# EAGLE design stmwerk (EAGLE 5.11)
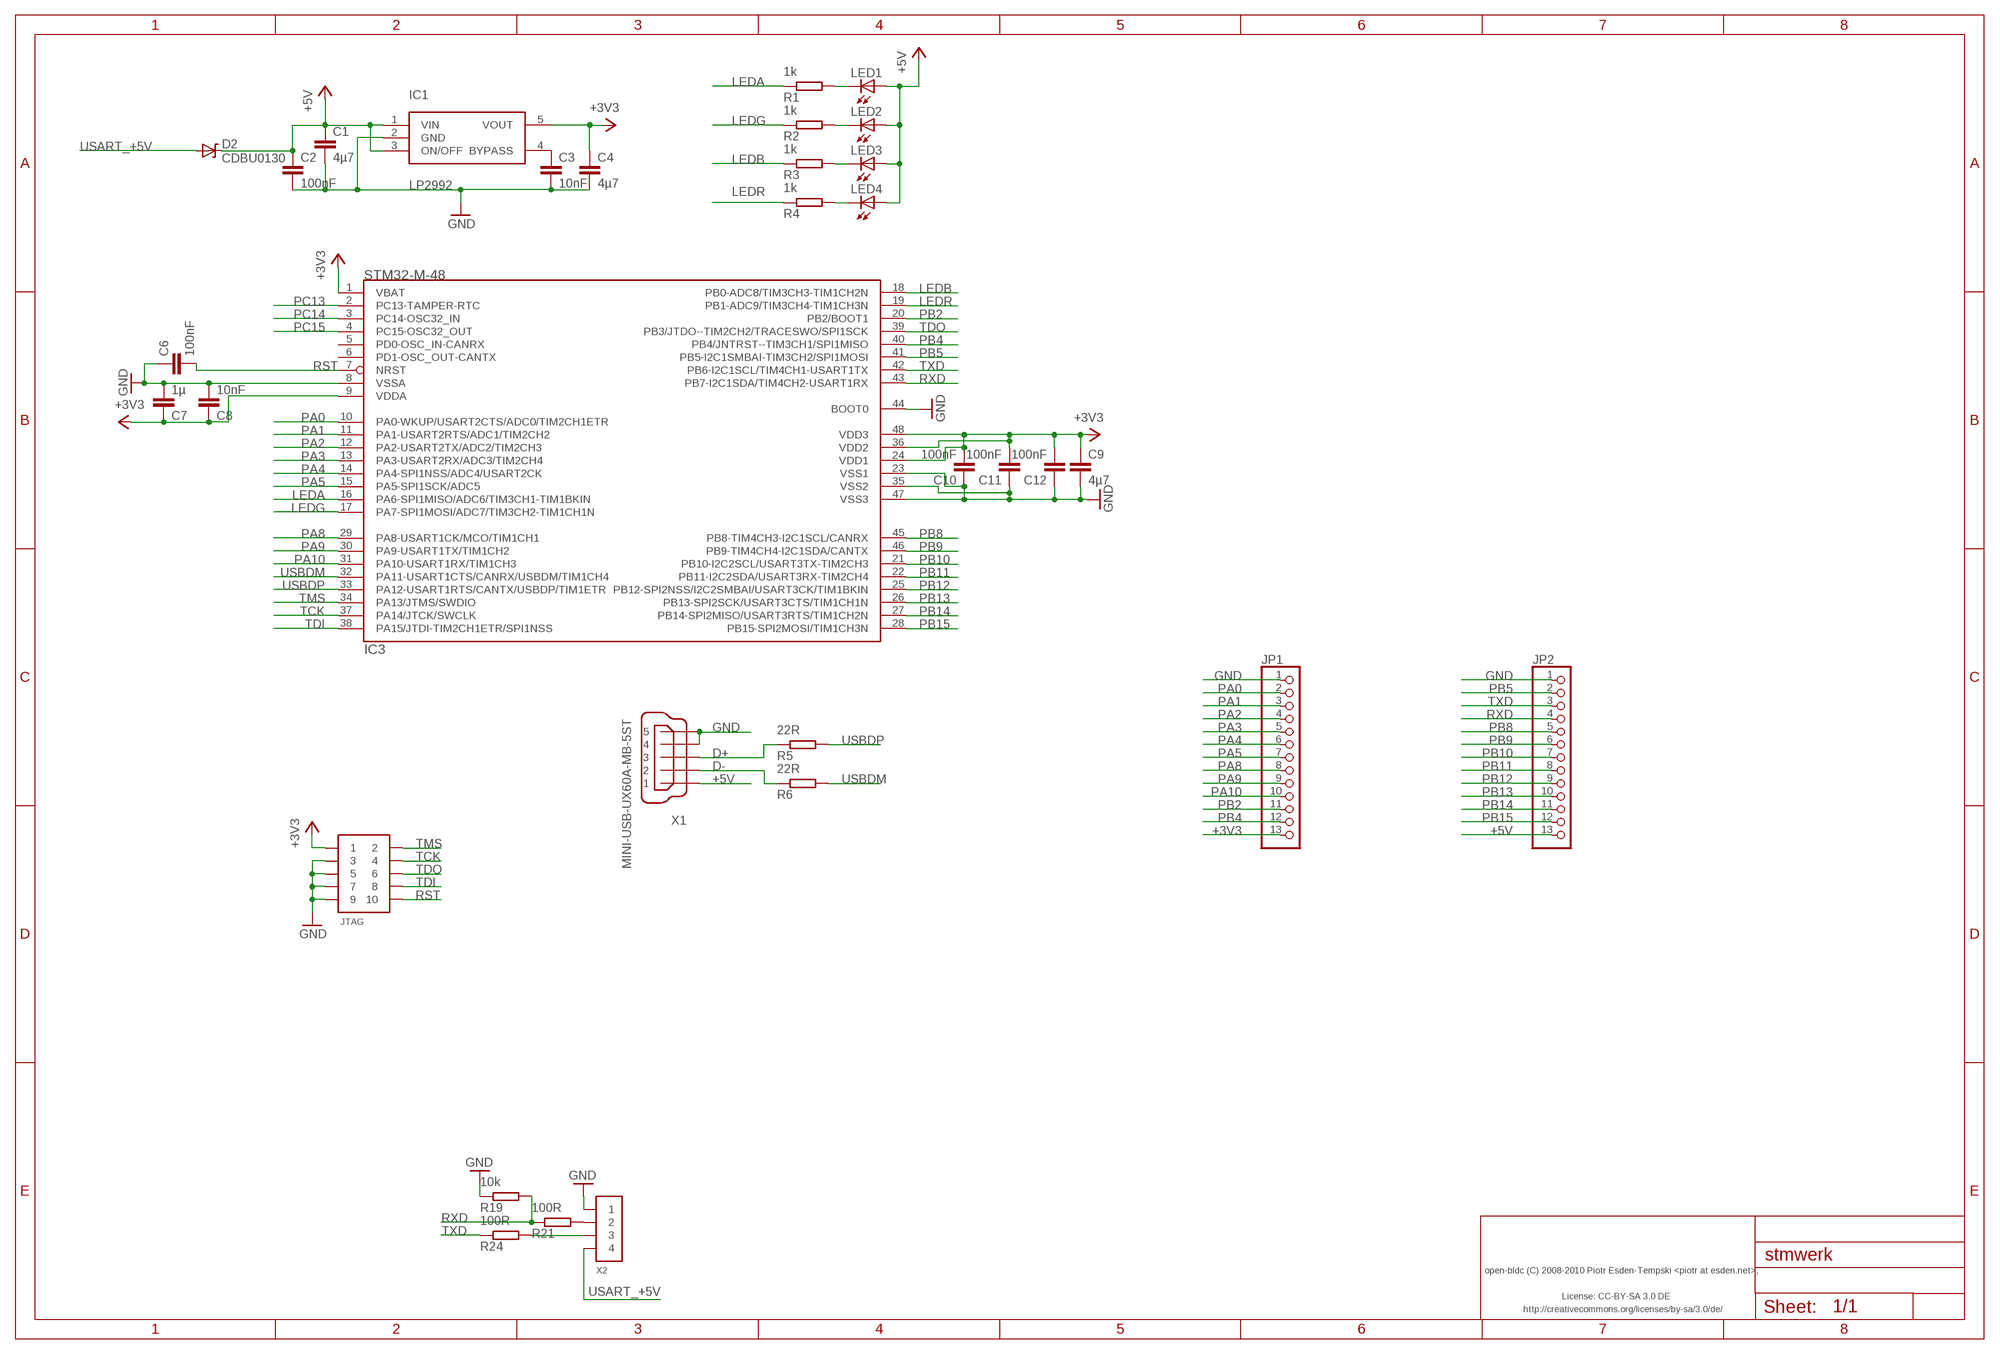
[diagram p0: schematic, sheet 1]

## Parts
C1  4µ7  CAPACITOR-0603  [0603-CAP]
C2  100nF  CAPACITOR-0603  [0603-CAP]
C3  10nF  CAPACITOR-0603  [0603-CAP]
C4  4µ7  CAPACITOR-0603  [0603-CAP]
C6  100nF  CAPACITOR-0603  [0603-CAP]
C7  1µ  CAPACITOR-0603  [0603-CAP]
C8  10nF  CAPACITOR-0603  [0603-CAP]
C9  4µ7  CAPACITOR-0603  [0603-CAP]
C10  100nF  CAPACITOR-0603  [0603-CAP]
C11  100nF  CAPACITOR-0603  [0603-CAP]
C12  100nF  CAPACITOR-0603  [0603-CAP]
D2  CDBU0130  DIODE-ZENER-0603  [0603-LED]
IC1  LP2992  [SOT23-5]
IC3  STM32-M-48  [LQFP48]
JP1  PINHD-1X13  [1X13]
JP2  PINHD-1X13  [1X13]
JTAG  CONN_5-2-FTSH-V  [FTSH-105-DV]
LED1  AMBER  LED-0603  [0603-LED]
LED2  GREEN  LED-0603  [0603-LED]
LED3  BLUE  LED-0603  [0603-LED]
LED4  RED  LED-0603  [0603-LED]
R1  1k  RESISTOR-0603  [0603-RES]
R2  1k  RESISTOR-0603  [0603-RES]
R3  1k  RESISTOR-0603  [0603-RES]
R4  1k  RESISTOR-0603  [0603-RES]
R5  22R  RESISTOR-0603  [0603-RES]
R6  22R  RESISTOR-0603  [0603-RES]
R19  10k  RESISTOR-0603  [0603-RES]
R21  100R  RESISTOR-0603  [0603-RES]
R24  100R  RESISTOR-0603  [0603-RES]
X1  MINI-USB-UX60A-MB-5ST  [UX60A-MB-5ST]
X2  CONN_4-1-53261  [PB-53261-04]

## Nets
+3V3: C4.P$1 C7.P$1 C8.P$1 C9.P$1 C10.P$2 C11.P$2 C12.P$2 IC1.5(VOUT) IC3.1(VBAT) IC3.9(VDDA) IC3.24(VDD1) IC3.36(VDD2) IC3.48(VDD3) JP1.13 JTAG.1
+5V: C1.P$1 C2.P$1 D2.C IC1.1(VIN) IC1.3(ON/OFF) JP2.13 LED1.A LED2.A LED3.A LED4.A X1.1
D+: R5.P$1 X1.3
D-: R6.P$1 X1.2
GND: C1.P$2 C2.P$2 C3.P$2 C4.P$2 C6.P$1 C7.P$2 C8.P$2 C9.P$2 C10.P$1 C11.P$1 C12.P$1 IC1.2(GND) IC3.8(VSSA) IC3.23(VSS1) IC3.35(VSS2) IC3.44(BOOT0) IC3.47(VSS3) JP1.1 JP2.1 JTAG.3 JTAG.5 JTAG.7 JTAG.9 R19.P$1 X1.4 X1.5 X2.1
LEDA: IC3.16(PA6-SPI1MISO/ADC6/TIM3CH1-TIM1BKIN) R1.P$1
LEDB: IC3.18(PB0-ADC8/TIM3CH3-TIM1CH2N) R3.P$1
LEDG: IC3.17(PA7-SPI1MOSI/ADC7/TIM3CH2-TIM1CH1N) R2.P$1
LEDR: IC3.19(PB1-ADC9/TIM3CH4-TIM1CH3N) R4.P$1
N$3: LED1.C R1.P$2
N$4: LED4.C R4.P$2
N$5: LED3.C R3.P$2
N$6: R21.P$2 X2.2
N$10: LED2.C R2.P$2
N$20: R24.P$2 X2.3
N$22: C3.P$1 IC1.4(BYPASS)
PA0: IC3.10(PA0-WKUP/USART2CTS/ADC0/TIM2CH1ETR) JP1.2
PA1: IC3.11(PA1-USART2RTS/ADC1/TIM2CH2) JP1.3
PA2: IC3.12(PA2-USART2TX/ADC2/TIM2CH3) JP1.4
PA3: IC3.13(PA3-USART2RX/ADC3/TIM2CH4) JP1.5
PA4: IC3.14(PA4-SPI1NSS/ADC4/USART2CK) JP1.6
PA5: IC3.15(PA5-SPI1SCK/ADC5) JP1.7
PA8: IC3.29(PA8-USART1CK/MCO/TIM1CH1) JP1.8
PA9: IC3.30(PA9-USART1TX/TIM1CH2) JP1.9
PA10: IC3.31(PA10-USART1RX/TIM1CH3) JP1.10
PB2: IC3.20(PB2/BOOT1) JP1.11
PB4: IC3.40(PB4/JNTRST--TIM3CH1/SPI1MISO) JP1.12
PB5: IC3.41(PB5-I2C1SMBAI-TIM3CH2/SPI1MOSI) JP2.2
PB8: IC3.45(PB8-TIM4CH3-I2C1SCL/CANRX) JP2.5
PB9: IC3.46(PB9-TIM4CH4-I2C1SDA/CANTX) JP2.6
PB10: IC3.21(PB10-I2C2SCL/USART3TX-TIM2CH3) JP2.7
PB11: IC3.22(PB11-I2C2SDA/USART3RX-TIM2CH4) JP2.8
PB12: IC3.25(PB12-SPI2NSS/I2C2SMBAI/USART3CK/TIM1BKIN) JP2.9
PB13: IC3.26(PB13-SPI2SCK/USART3CTS/TIM1CH1N) JP2.10
PB14: IC3.27(PB14-SPI2MISO/USART3RTS/TIM1CH2N) JP2.11
PB15: IC3.28(PB15-SPI2MOSI/TIM1CH3N) JP2.12
PC13: IC3.2(PC13-TAMPER-RTC)
PC14: IC3.3(PC14-OSC32_IN)
PC15: IC3.4(PC15-OSC32_OUT)
RST: C6.P$2 IC3.7(NRST) JTAG.10
RXD: IC3.43(PB7-I2C1SDA/TIM4CH2-USART1RX) JP2.4 R19.P$2 R21.P$1
TCK: IC3.37(PA14/JTCK/SWCLK) JTAG.4
TDI: IC3.38(PA15/JTDI-TIM2CH1ETR/SPI1NSS) JTAG.8
TDO: IC3.39(PB3/JTDO--TIM2CH2/TRACESWO/SPI1SCK) JTAG.6
TMS: IC3.34(PA13/JTMS/SWDIO) JTAG.2
TXD: IC3.42(PB6-I2C1SCL/TIM4CH1-USART1TX) JP2.3 R24.P$1
USART_+5V: D2.A X2.4
USBDM: IC3.32(PA11-USART1CTS/CANRX/USBDM/TIM1CH4) R6.P$2
USBDP: IC3.33(PA12-USART1RTS/CANTX/USBDP/TIM1ETR) R5.P$2
Unconnected: IC3.5(PD0-OSC_IN-CANRX) IC3.6(PD1-OSC_OUT-CANTX)

## Notes on the sheet
- open-bldc (C) 2008-2010 Piotr Esden-Tempski <piotr at esden.net>,
- License: CC-BY-SA 3.0 DE
- http://creativecommons.org/licenses/by-sa/3.0/de/

## Library data of the parts
C1-C4 C6-C12 = pel_dipol_comp:CAPACITOR
D2 = pel_dipol_comp:DIODE-ZENER
IC1 = open-bldc:LP2992
IC3 = pel_stm32:STM32-M-48: STM32F103 Medium Density 48pins
JP1 JP2 = pinhead:PINHD-1X13: PIN HEADER
JTAG = pel_misc:CONN_5-2
LED1-LED4 = pel_dipol_comp:LED
R1-R6 R19 R21 R24 = pel_dipol_comp:RESISTOR
X1 = con-hirose:MINI-USB-: MINI USB Connector Source: http://www.hirose.co.jp/cataloge_hp/e24000019.pdf; OC_FARNELL: unknown; OC_NEWARK: unknown
X2 = pel_molex:CONN_4-1

## Board
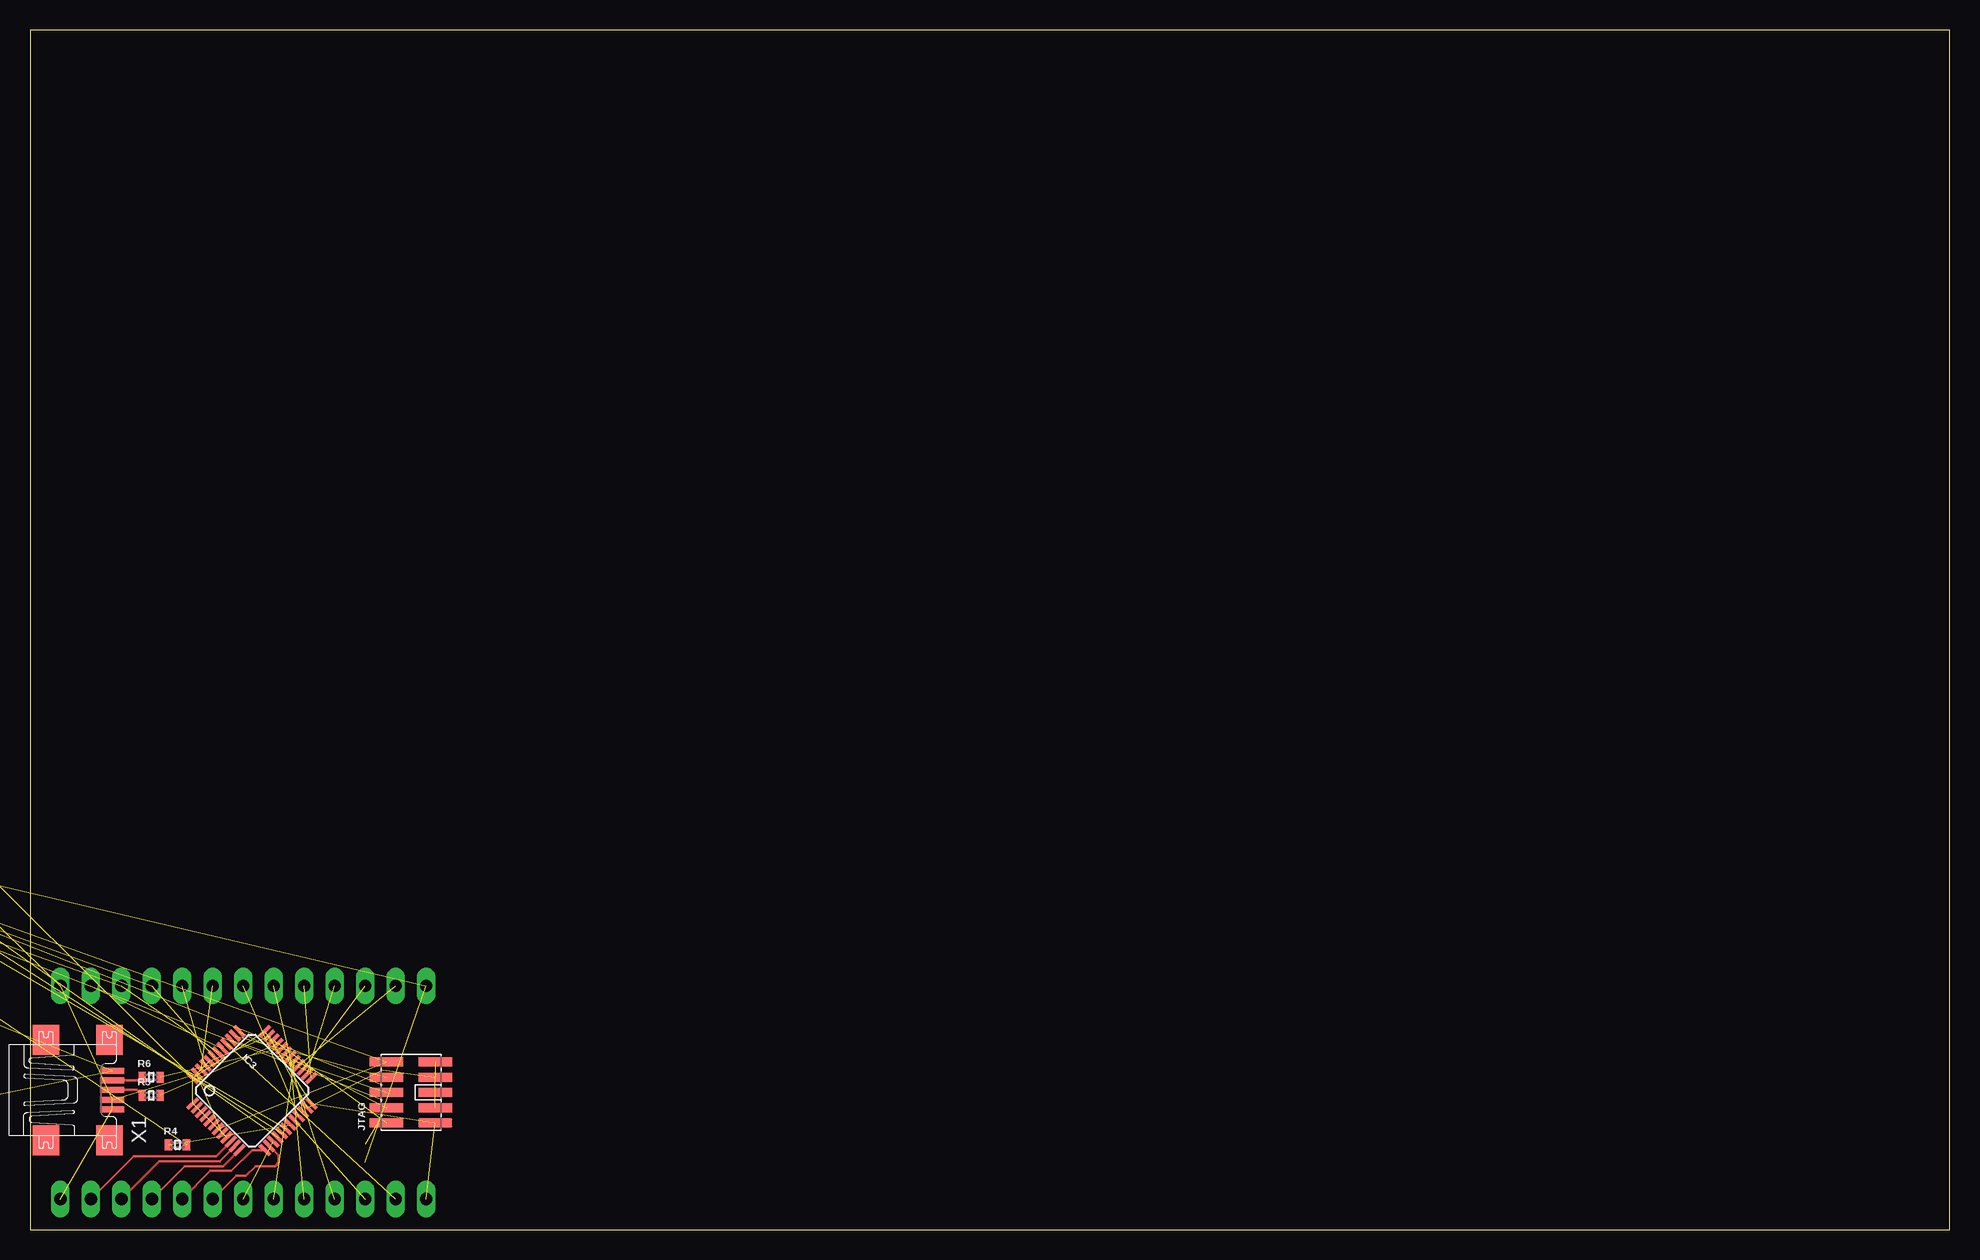
[diagram p1: board, top side]
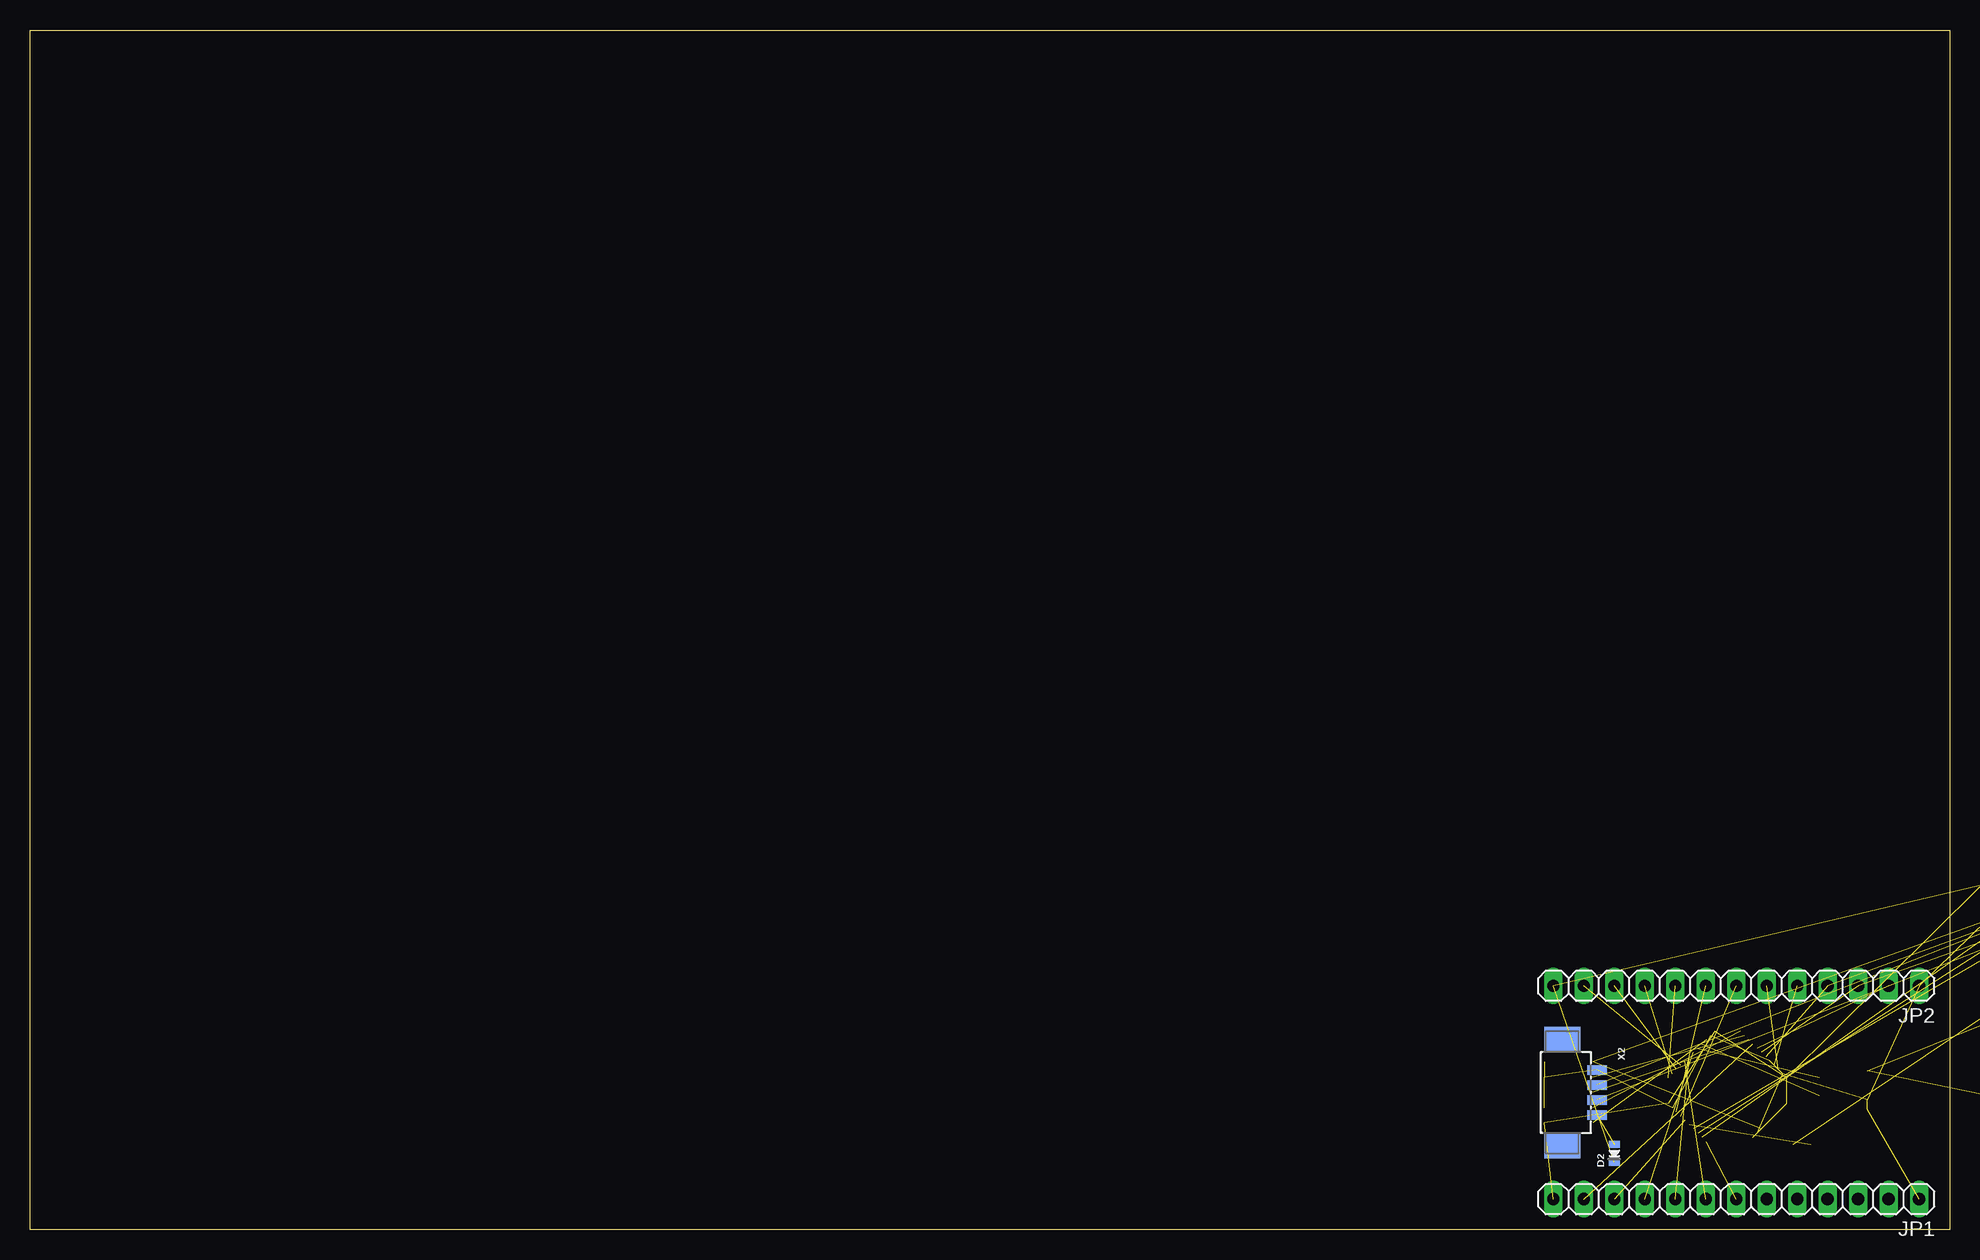
[diagram p2: board, bottom side, seen from below]

Size 160 x 100 mm. Coordinates in mm from the lower left corner, seen from the top.
Outline: 0,0 160,0 160,100 0,100 0,0
Copper layers (1*16): Top 0.035mm / dielectric 1.5mm / Bottom 0.035mm
Design rules "default": minimum track width 10mil, minimum drill 24mil, track to track 8mil, track to pad 8mil, pad to pad 8mil, via to via 8mil, smd to smd 8mil, copper to edge 40mil, drill to drill 8mil, minimum pad ring 10mil, minimum via ring 8mil, stop-mask expansion 4mil, vias tented up to drill 0mil, thermal gap 10mil

### Footprints (pad centres in the part's own frame; a part is rotated, then mirrored left to right if it is on the bottom)
0603-CAP = smd 0.6 x 0.9: P$1 -0.75,0; P$2 0.75,0
0603-LED = smd 0.6 x 0.9: A 0.75,0; C -0.75,0
SOT23-5 = smd 0.55 x 1.2: 1 -0.95,-1.3; 2 0,-1.3; 3 0.95,-1.3; 4 0.95,1.3; 5 -0.95,1.3
LQFP48 = smd 0.3 x 1.2: 1 -2.75,-4.25; 2 -2.25,-4.25; 3 -1.75,-4.25; 4 -1.25,-4.25; 5 -0.75,-4.25; 6 -0.25,-4.25; 7 0.25,-4.25; 8 0.75,-4.25; 9 1.25,-4.25; 10 1.75,-4.25; 11 2.25,-4.25; 12 2.75,-4.25; 25 2.75,4.25; 26 2.25,4.25; 27 1.75,4.25; 28 1.25,4.25; 29 0.75,4.25; 30 0.25,4.25; 31 -0.25,4.25; 32 -0.75,4.25; 33 -1.25,4.25; 34 -1.75,4.25; 35 -2.25,4.25; 36 -2.75,4.25 | smd 1.2 x 0.3: 13 4.25,-2.75; 14 4.25,-2.25; 15 4.25,-1.75; 16 4.25,-1.25; 17 4.25,-0.75; 18 4.25,-0.25; 19 4.25,0.25; 20 4.25,0.75; 21 4.25,1.25; 22 4.25,1.75; 23 4.25,2.25; 24 4.25,2.75; 37 -4.25,2.75; 38 -4.25,2.25; 39 -4.25,1.75; 40 -4.25,1.25; 41 -4.25,0.75; 42 -4.25,0.25; 43 -4.25,-0.25; 44 -4.25,-0.75; 45 -4.25,-1.25; 46 -4.25,-1.75; 47 -4.25,-2.25; 48 -4.25,-2.75
1X13 = drill 1.016 long: 1 -15.24,0; 2 -12.7,0; 3 -10.16,0; 4 -7.62,0; 5 -5.08,0; 6 -2.54,0; 7 0,0; 8 2.54,0; 9 5.08,0; 10 7.62,0; 11 10.16,0; 12 12.7,0; 13 15.24,0
FTSH-105-DV = smd 0.74 x 2.8: 1 -2.54,-2.03; 2 -2.54,2.03; 3 -1.27,-2.03; 4 -1.27,2.03; 5 0,-2.03; 6 0,2.03; 7 1.27,-2.03; 8 1.27,2.03; 9 2.54,-2.03; 10 2.54,2.03
0603-RES = smd 0.6 x 0.9: P$1 -0.75,0; P$2 0.75,0
UX60A-MB-5ST = smd 2 x 0.5: 1 2.25,1.6; 2 2.25,0.8; 3 2.25,0; 4 2.25,-0.8; 5 2.25,-1.6 | smd 2.2 x 2.5: M1 -3.3,-4.2; M2 -3.3,4.2; M3 2,4.2; M4 2,-4.2
PB-53261-04 = smd 0.8 x 1.6: 1 -1.875,1.1; 2 -0.625,1.1; 3 0.625,1.1; 4 1.875,1.1 | smd 2.1 x 3: MNT1 -4.425,-1.8; MNT2 4.425,-1.8

### Placement (x,y rotation side)
C1  -41.91,36.83 0 top  (outside the outline)
C2  -20.32,33.02 0 top  (outside the outline)
C3  -15.24,36.83 0 top  (outside the outline)
C4  -13.97,40.64 0 top  (outside the outline)
C6  -24.13,33.02 0 top  (outside the outline)
C7  -17.78,40.64 0 top  (outside the outline)
C8  -22.86,36.83 0 top  (outside the outline)
C9  -21.59,40.64 0 top  (outside the outline)
C10  -27.94,33.02 0 top  (outside the outline)
C11  -31.75,33.02 0 top  (outside the outline)
C12  -35.56,33.02 0 top  (outside the outline)
D2  27.94,6.35 90 bottom
IC1  -38.1,5.08 0 top  (outside the outline)
IC3  18.51,11.57 315 top
JP1  17.78,2.54 180 bottom
JP2  17.78,20.32 180 bottom
JTAG  31.75,11.43 90 top
LED1  -39.37,33.02 0 top  (outside the outline)
LED2  -43.18,33.02 0 top  (outside the outline)
LED3  -26.67,36.83 0 top  (outside the outline)
LED4  -30.48,36.83 0 top  (outside the outline)
R1  -25.4,40.64 0 top  (outside the outline)
R2  -29.21,40.64 0 top  (outside the outline)
R3  -33.02,40.64 0 top  (outside the outline)
R4  12.29,7.06 0 top
R5  10.11,11.18 0 top
R6  10.11,12.7 0 top
R19  -40.64,40.64 0 top  (outside the outline)
R21  -34.29,36.83 0 top  (outside the outline)
R24  -38.1,36.83 0 top  (outside the outline)
X1  4.62,11.63 0 top
X2  30.48,11.43 270 bottom

### Tracks (layer width: path | path; a pad name or v marks a point on that pad's centre or on a via)
+3V3  (14 unrouted)
+5V  (10 unrouted)
D+
  Top 0.203: X1.3 8.9,11.63 R5.P$1
D-
  Top 0.203: X1.2 9.09,12.43 R6.P$1
GND  (26 unrouted)
LEDA  (1 unrouted)
LEDB  (1 unrouted)
LEDG  (1 unrouted)
LEDR  (1 unrouted)
N$3  (1 unrouted)
N$4  (1 unrouted)
N$5  (1 unrouted)
N$6  (1 unrouted)
N$10  (1 unrouted)
N$20  (1 unrouted)
N$22  (1 unrouted)
PA0
  Top 0.203: IC3.10 15.51,6.1 15.24,6.1 8.64,6.1 JP1.2
PA1
  Top 0.203: IC3.11 15.81,5.69 15.65,5.69 10.77,5.69 JP1.3
PA2
  Top 0.203: IC3.12 16.11,5.28 15.85,5.28 12.9,5.28 JP1.4
PA3
  Top 0.203: JP1.5 15.04,4.88 16.76,4.88 18.51,6.62 IC3.13
PA4
  Top 0.203: JP1.6 17.17,4.47 17.98,4.47 18.8,5.28 20.42,5.28 20.73,5.59 20.73,6.17 IC3.14
PA5  (1 unrouted)
PA8  (1 unrouted)
PA9  (1 unrouted)
PA10  (1 unrouted)
PB2  (1 unrouted)
PB4  (1 unrouted)
PB5  (1 unrouted)
PB8  (1 unrouted)
PB9  (1 unrouted)
PB10  (1 unrouted)
PB11  (1 unrouted)
PB12  (1 unrouted)
PB13  (1 unrouted)
PB14  (1 unrouted)
PB15  (1 unrouted)
RST  (2 unrouted)
RXD  (3 unrouted)
TCK  (1 unrouted)
TDI  (1 unrouted)
TDO  (1 unrouted)
TMS  (1 unrouted)
TXD  (2 unrouted)
USART_+5V  (1 unrouted)
USBDM  (1 unrouted)
USBDP  (1 unrouted)